# Altium schematic sheet STM-Interface.SchDoc
size A4; SheetNumber: 6; SheetTotal: 8
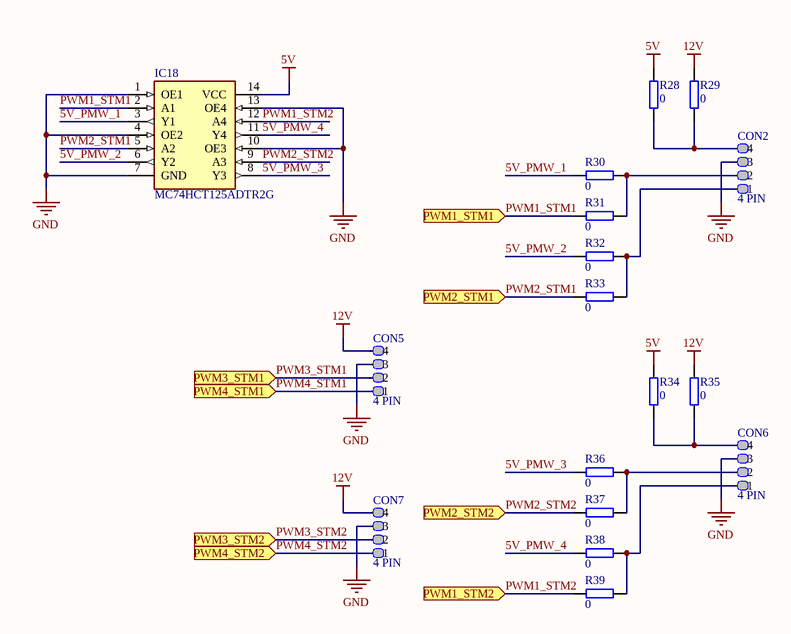
[diagram p0: STM-Interface.SchDoc]

## Parts
CON2  4 PIN  [BM04B-SRSS-TB]
CON5  4 PIN  [BM04B-SRSS-TB]
CON6  4 PIN  [BM04B-SRSS-TB]
CON7  4 PIN  [BM04B-SRSS-TB]
IC18  MC74HCT125ADTR2G  [SOP65P640X120-14N]
R28  0  [R 0402]
R29  0  [R 0402]
R30  0  [R 0402]
R31  0  [R 0402]
R32  0  [R 0402]
R33  0  [R 0402]
R34  0  [R 0402]
R35  0  [R 0402]
R36  0  [R 0402]
R37  0  [R 0402]
R38  0  [R 0402]
R39  0  [R 0402]

## Ports
PWM1_STM1 (in), PWM1_STM2 (in), PWM2_STM1 (in), PWM2_STM2 (in), PWM3_STM1 (in), PWM3_STM2 (in), PWM4_STM1 (in), PWM4_STM2 (in)

## Nets
5V: IC18.14(VCC) R28.2 R34.2
12V: CON5.4 CON7.4 R29.2 R35.2
GND: CON2.3 CON5.3 CON6.3 CON7.3 IC18.1(OE1) IC18.4(OE2) IC18.7(GND) IC18.10(OE3) IC18.13(OE4)
5V_PMW_1: IC18.3(Y1) R30.2
5V_PMW_2: IC18.6(Y2) R32.2
5V_PMW_3: IC18.8(Y3) R36.2
5V_PMW_4: IC18.11(Y4) R38.2
PWM1_STM1: IC18.2(A1) R31.2 ; port PWM1_STM1
PWM1_STM2: IC18.12(A4) R39.2 ; port PWM1_STM2
PWM2_STM1: IC18.5(A2) R33.2 ; port PWM2_STM1
PWM2_STM2: IC18.9(A3) R37.2 ; port PWM2_STM2
PWM3_STM1: CON5.2 ; port PWM3_STM1
PWM3_STM2: CON7.2 ; port PWM3_STM2
PWM4_STM1: CON5.1 ; port PWM4_STM1
PWM4_STM2: CON7.1 ; port PWM4_STM2
NetCON2_1: CON2.1 R32.1 R33.1
NetCON2_2: CON2.2 R30.1 R31.1
NetCON2_4: CON2.4 R28.1 R29.1
NetCON6_1: CON6.1 R38.1 R39.1
NetCON6_2: CON6.2 R36.1 R37.1
NetCON6_4: CON6.4 R34.1 R35.1

## Library data of the parts
IC18 = MC74HCT125ADTR2G: Integrated Circuit; Manufacturer_Name: onsemi; Datasheet Link: https://www.onsemi.com/pub/Collateral/MC74HC125A-D.PDF; Height: 1.2mm; Manufacturer_Part_Number: MC74HCT125ADTR2G; Mouser Part Number: 863-MC74HCT125ADTR2G; Mouser Price/Stock: https://www.mouser.co.uk/ProductDetail/onsemi/MC74HCT125ADTR2G?qs=mB5q98eOMcZnEC08OY8tTw%3D%3D; Arrow Part Number: MC74HCT125ADTR2G; Arrow Price/Stock: https://www.arrow.com/en/products/mc74hct125adtr2g/on-semiconductor?utm_currency=USD&region=nac
R28-R39 = Resistor: General pourpouse resistor